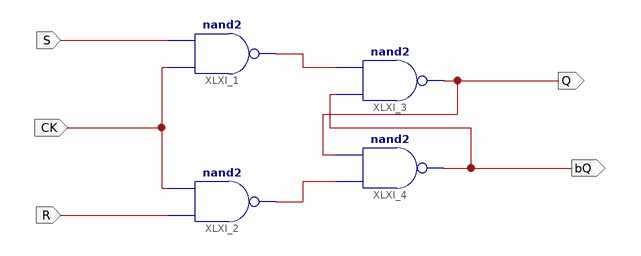
[diagram p0: schematic sheet 1]
// Xilinx ISE schematic SR_FF_C.sch (spartan6) as structural Verilog: 4 symbols, 5 ports
module SR_FF_C (
  input  CK,
  input  R,
  input  S,
  output bQ,
  output Q
);

  wire XLXN_1, XLXN_2;

  nand XLXI_1 (XLXN_1, CK, S);
  nand XLXI_2 (XLXN_2, R, CK);
  nand XLXI_3 (Q, bQ, XLXN_1);
  nand XLXI_4 (bQ, XLXN_2, Q);
endmodule
